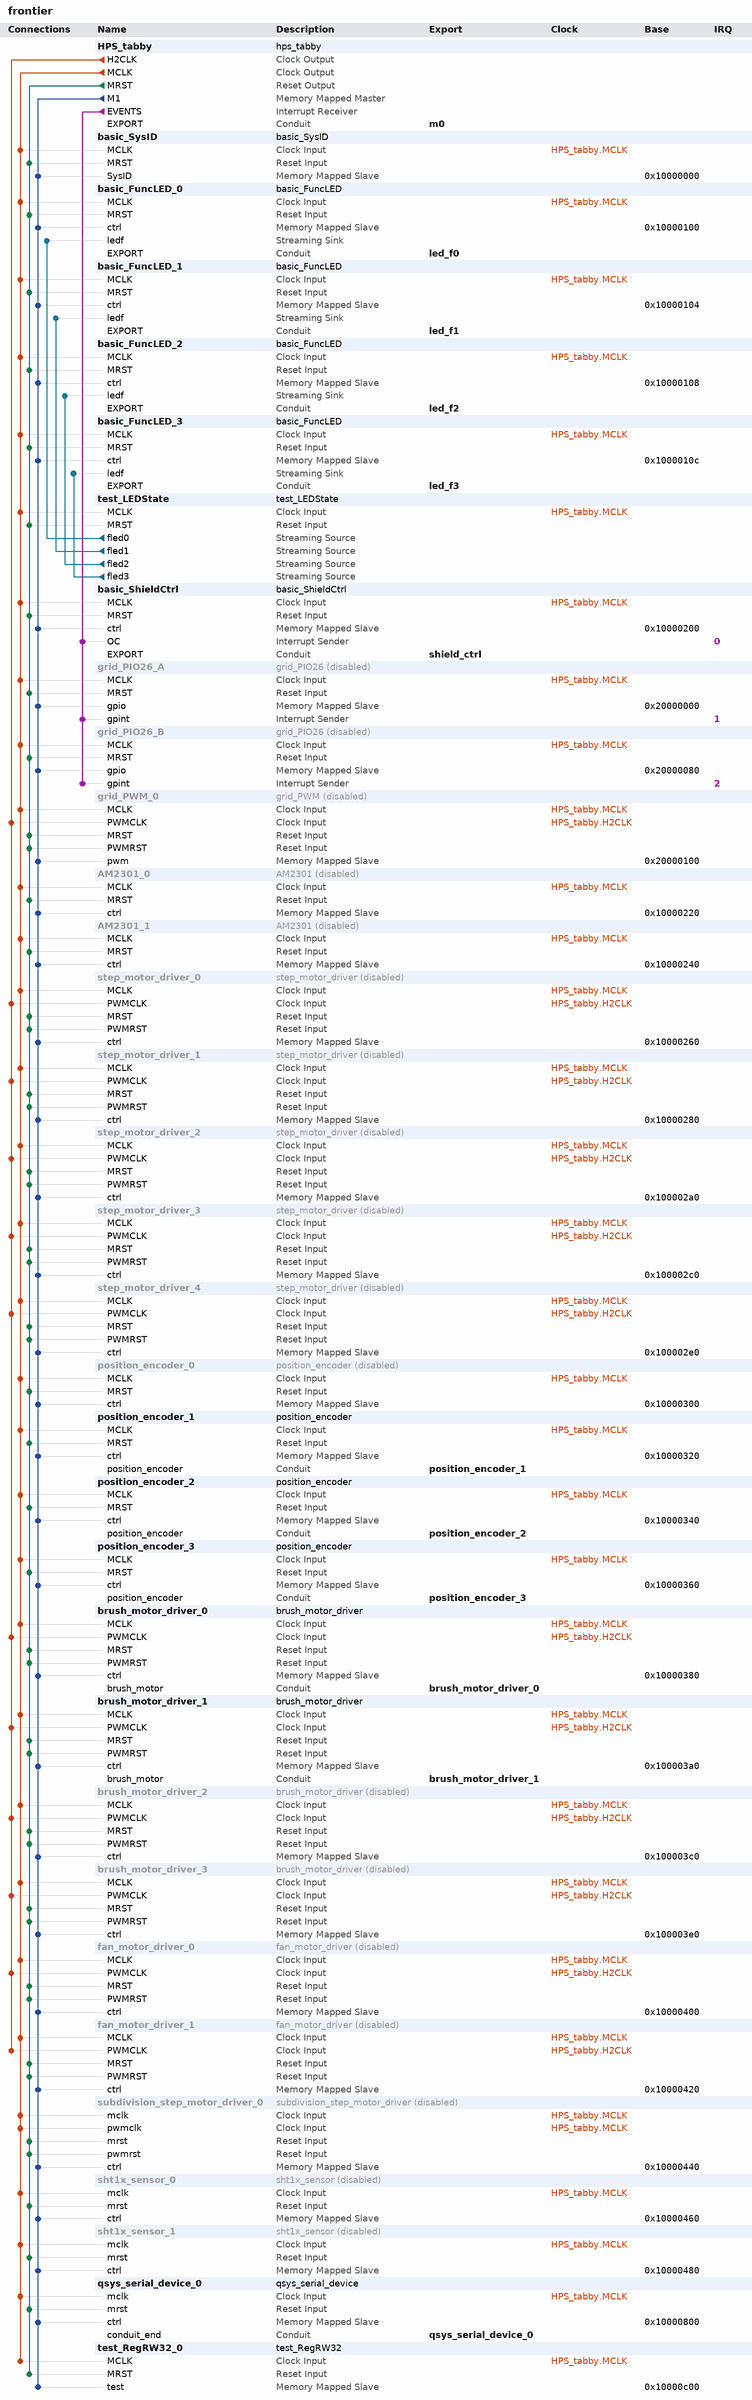
[diagram p0: system contents]
# Platform Designer (Qsys) system frontier, Cyclone IV E EP4CE15F23C8
# Parameters at their usual value, and those the tool derives, are not listed.
package require qsys
create_system frontier
set_project_property DEVICE_FAMILY {Cyclone IV E}
set_project_property DEVICE EP4CE15F23C8

add_instance HPS_tabby hps_tabby 1.1

add_instance basic_SysID basic_SysID 1.0

add_instance basic_FuncLED_0 basic_FuncLED 1.0

add_instance basic_FuncLED_1 basic_FuncLED 1.0

add_instance basic_FuncLED_2 basic_FuncLED 1.0

add_instance basic_FuncLED_3 basic_FuncLED 1.0

add_instance test_LEDState test_LEDState 1.0

add_instance basic_ShieldCtrl basic_ShieldCtrl 1.0

add_instance grid_PIO26_A grid_PIO26 1.0
set_instance_property grid_PIO26_A ENABLED false

add_instance grid_PIO26_B grid_PIO26 1.0
set_instance_property grid_PIO26_B ENABLED false

add_instance grid_PWM_0 grid_PWM 1.0
set_instance_property grid_PWM_0 ENABLED false

add_instance AM2301_0 AM2301 1.0
set_instance_property AM2301_0 ENABLED false
set_instance_parameter_value AM2301_0 high_width 20
set_instance_parameter_value AM2301_0 start_width 1000
set_instance_parameter_value AM2301_0 start 0
set_instance_parameter_value AM2301_0 start_read 1
set_instance_parameter_value AM2301_0 start_end 2
set_instance_parameter_value AM2301_0 start_low 3
set_instance_parameter_value AM2301_0 start_high 4
set_instance_parameter_value AM2301_0 bit_1_low 5
set_instance_parameter_value AM2301_0 bit_1_high 6
set_instance_parameter_value AM2301_0 bit_2_low 7
set_instance_parameter_value AM2301_0 bit_2_high 8
set_instance_parameter_value AM2301_0 bit_3_low 9
set_instance_parameter_value AM2301_0 bit_3_high 10
set_instance_parameter_value AM2301_0 bit_4_low 11
set_instance_parameter_value AM2301_0 bit_4_high 12
set_instance_parameter_value AM2301_0 bit_5_low 13
set_instance_parameter_value AM2301_0 bit_5_high 14
set_instance_parameter_value AM2301_0 bit_6_low 15
set_instance_parameter_value AM2301_0 bit_6_high 16
set_instance_parameter_value AM2301_0 bit_7_low 17
set_instance_parameter_value AM2301_0 bit_7_high 18
set_instance_parameter_value AM2301_0 bit_8_low 19
set_instance_parameter_value AM2301_0 bit_8_high 20
set_instance_parameter_value AM2301_0 bit_9_low 21
set_instance_parameter_value AM2301_0 bit_9_high 22
set_instance_parameter_value AM2301_0 bit_10_low 23
set_instance_parameter_value AM2301_0 bit_10_high 24
set_instance_parameter_value AM2301_0 bit_11_low 25
set_instance_parameter_value AM2301_0 bit_11_high 26
set_instance_parameter_value AM2301_0 bit_12_low 27
set_instance_parameter_value AM2301_0 bit_12_high 28
set_instance_parameter_value AM2301_0 bit_13_low 29
set_instance_parameter_value AM2301_0 bit_13_high 30
set_instance_parameter_value AM2301_0 bit_14_low 31
set_instance_parameter_value AM2301_0 bit_14_high 32
set_instance_parameter_value AM2301_0 bit_15_low 33
set_instance_parameter_value AM2301_0 bit_15_high 34
set_instance_parameter_value AM2301_0 bit_16_low 35
set_instance_parameter_value AM2301_0 bit_16_high 36
set_instance_parameter_value AM2301_0 bit_17_low 37
set_instance_parameter_value AM2301_0 bit_17_high 38
set_instance_parameter_value AM2301_0 bit_18_low 39
set_instance_parameter_value AM2301_0 bit_18_high 40
set_instance_parameter_value AM2301_0 bit_19_low 41
set_instance_parameter_value AM2301_0 bit_19_high 42
set_instance_parameter_value AM2301_0 bit_20_low 43
set_instance_parameter_value AM2301_0 bit_20_high 44
set_instance_parameter_value AM2301_0 bit_21_low 45
set_instance_parameter_value AM2301_0 bit_21_high 46
set_instance_parameter_value AM2301_0 bit_22_low 47
set_instance_parameter_value AM2301_0 bit_22_high 48
set_instance_parameter_value AM2301_0 bit_23_low 49
set_instance_parameter_value AM2301_0 bit_23_high 50
set_instance_parameter_value AM2301_0 bit_24_low 51
set_instance_parameter_value AM2301_0 bit_24_high 52
set_instance_parameter_value AM2301_0 bit_25_low 53
set_instance_parameter_value AM2301_0 bit_25_high 54
set_instance_parameter_value AM2301_0 bit_26_low 55
set_instance_parameter_value AM2301_0 bit_26_high 56
set_instance_parameter_value AM2301_0 bit_27_low 57
set_instance_parameter_value AM2301_0 bit_27_high 58
set_instance_parameter_value AM2301_0 bit_28_low 59
set_instance_parameter_value AM2301_0 bit_28_high 60
set_instance_parameter_value AM2301_0 bit_29_low 61
set_instance_parameter_value AM2301_0 bit_29_high 62
set_instance_parameter_value AM2301_0 bit_30_low 63
set_instance_parameter_value AM2301_0 bit_30_high 64
set_instance_parameter_value AM2301_0 bit_31_low 65
set_instance_parameter_value AM2301_0 bit_31_high 66
set_instance_parameter_value AM2301_0 bit_32_low 67
set_instance_parameter_value AM2301_0 bit_32_high 68
set_instance_parameter_value AM2301_0 ready 90
set_instance_parameter_value AM2301_0 time_2s 2000000

add_instance AM2301_1 AM2301 1.0
set_instance_property AM2301_1 ENABLED false
set_instance_parameter_value AM2301_1 high_width 20
set_instance_parameter_value AM2301_1 start_width 1000
set_instance_parameter_value AM2301_1 start 0
set_instance_parameter_value AM2301_1 start_read 1
set_instance_parameter_value AM2301_1 start_end 2
set_instance_parameter_value AM2301_1 start_low 3
set_instance_parameter_value AM2301_1 start_high 4
set_instance_parameter_value AM2301_1 bit_1_low 5
set_instance_parameter_value AM2301_1 bit_1_high 6
set_instance_parameter_value AM2301_1 bit_2_low 7
set_instance_parameter_value AM2301_1 bit_2_high 8
set_instance_parameter_value AM2301_1 bit_3_low 9
set_instance_parameter_value AM2301_1 bit_3_high 10
set_instance_parameter_value AM2301_1 bit_4_low 11
set_instance_parameter_value AM2301_1 bit_4_high 12
set_instance_parameter_value AM2301_1 bit_5_low 13
set_instance_parameter_value AM2301_1 bit_5_high 14
set_instance_parameter_value AM2301_1 bit_6_low 15
set_instance_parameter_value AM2301_1 bit_6_high 16
set_instance_parameter_value AM2301_1 bit_7_low 17
set_instance_parameter_value AM2301_1 bit_7_high 18
set_instance_parameter_value AM2301_1 bit_8_low 19
set_instance_parameter_value AM2301_1 bit_8_high 20
set_instance_parameter_value AM2301_1 bit_9_low 21
set_instance_parameter_value AM2301_1 bit_9_high 22
set_instance_parameter_value AM2301_1 bit_10_low 23
set_instance_parameter_value AM2301_1 bit_10_high 24
set_instance_parameter_value AM2301_1 bit_11_low 25
set_instance_parameter_value AM2301_1 bit_11_high 26
set_instance_parameter_value AM2301_1 bit_12_low 27
set_instance_parameter_value AM2301_1 bit_12_high 28
set_instance_parameter_value AM2301_1 bit_13_low 29
set_instance_parameter_value AM2301_1 bit_13_high 30
set_instance_parameter_value AM2301_1 bit_14_low 31
set_instance_parameter_value AM2301_1 bit_14_high 32
set_instance_parameter_value AM2301_1 bit_15_low 33
set_instance_parameter_value AM2301_1 bit_15_high 34
set_instance_parameter_value AM2301_1 bit_16_low 35
set_instance_parameter_value AM2301_1 bit_16_high 36
set_instance_parameter_value AM2301_1 bit_17_low 37
set_instance_parameter_value AM2301_1 bit_17_high 38
set_instance_parameter_value AM2301_1 bit_18_low 39
set_instance_parameter_value AM2301_1 bit_18_high 40
set_instance_parameter_value AM2301_1 bit_19_low 41
set_instance_parameter_value AM2301_1 bit_19_high 42
set_instance_parameter_value AM2301_1 bit_20_low 43
set_instance_parameter_value AM2301_1 bit_20_high 44
set_instance_parameter_value AM2301_1 bit_21_low 45
set_instance_parameter_value AM2301_1 bit_21_high 46
set_instance_parameter_value AM2301_1 bit_22_low 47
set_instance_parameter_value AM2301_1 bit_22_high 48
set_instance_parameter_value AM2301_1 bit_23_low 49
set_instance_parameter_value AM2301_1 bit_23_high 50
set_instance_parameter_value AM2301_1 bit_24_low 51
set_instance_parameter_value AM2301_1 bit_24_high 52
set_instance_parameter_value AM2301_1 bit_25_low 53
set_instance_parameter_value AM2301_1 bit_25_high 54
set_instance_parameter_value AM2301_1 bit_26_low 55
set_instance_parameter_value AM2301_1 bit_26_high 56
set_instance_parameter_value AM2301_1 bit_27_low 57
set_instance_parameter_value AM2301_1 bit_27_high 58
set_instance_parameter_value AM2301_1 bit_28_low 59
set_instance_parameter_value AM2301_1 bit_28_high 60
set_instance_parameter_value AM2301_1 bit_29_low 61
set_instance_parameter_value AM2301_1 bit_29_high 62
set_instance_parameter_value AM2301_1 bit_30_low 63
set_instance_parameter_value AM2301_1 bit_30_high 64
set_instance_parameter_value AM2301_1 bit_31_low 65
set_instance_parameter_value AM2301_1 bit_31_high 66
set_instance_parameter_value AM2301_1 bit_32_low 67
set_instance_parameter_value AM2301_1 bit_32_high 68
set_instance_parameter_value AM2301_1 ready 90
set_instance_parameter_value AM2301_1 time_2s 2000000

add_instance step_motor_driver_0 step_motor_driver 1.0
set_instance_property step_motor_driver_0 ENABLED false

add_instance step_motor_driver_1 step_motor_driver 1.0
set_instance_property step_motor_driver_1 ENABLED false

add_instance step_motor_driver_2 step_motor_driver 1.0
set_instance_property step_motor_driver_2 ENABLED false

add_instance step_motor_driver_3 step_motor_driver 1.0
set_instance_property step_motor_driver_3 ENABLED false

add_instance step_motor_driver_4 step_motor_driver 1.0
set_instance_property step_motor_driver_4 ENABLED false

add_instance position_encoder_0 position_encoder 1.0
set_instance_property position_encoder_0 ENABLED false

add_instance position_encoder_1 position_encoder 1.0

add_instance position_encoder_2 position_encoder 1.0

add_instance position_encoder_3 position_encoder 1.0

add_instance brush_motor_driver_0 brush_motor_driver 1.0

add_instance brush_motor_driver_1 brush_motor_driver 1.0

add_instance brush_motor_driver_2 brush_motor_driver 1.0
set_instance_property brush_motor_driver_2 ENABLED false

add_instance brush_motor_driver_3 brush_motor_driver 1.0
set_instance_property brush_motor_driver_3 ENABLED false

add_instance fan_motor_driver_0 fan_motor_driver 1.0
set_instance_property fan_motor_driver_0 ENABLED false

add_instance fan_motor_driver_1 fan_motor_driver 1.0
set_instance_property fan_motor_driver_1 ENABLED false

add_instance subdivision_step_motor_driver_0 subdivision_step_motor_driver 1.0
set_instance_property subdivision_step_motor_driver_0 ENABLED false

add_instance sht1x_sensor_0 sht1x_sensor 1.0
set_instance_property sht1x_sensor_0 ENABLED false
set_instance_parameter_value sht1x_sensor_0 Address 0
set_instance_parameter_value sht1x_sensor_0 Measure_Temperature 3
set_instance_parameter_value sht1x_sensor_0 Measure_Relative_Humidity 5
set_instance_parameter_value sht1x_sensor_0 Read_Status_Register 7
set_instance_parameter_value sht1x_sensor_0 Write_Status_Register 6
set_instance_parameter_value sht1x_sensor_0 dir_out 1
set_instance_parameter_value sht1x_sensor_0 dir_in 0
set_instance_parameter_value sht1x_sensor_0 Reset_0 0

add_instance sht1x_sensor_1 sht1x_sensor 1.0
set_instance_property sht1x_sensor_1 ENABLED false
set_instance_parameter_value sht1x_sensor_1 Address 0
set_instance_parameter_value sht1x_sensor_1 Measure_Temperature 3
set_instance_parameter_value sht1x_sensor_1 Measure_Relative_Humidity 5
set_instance_parameter_value sht1x_sensor_1 Read_Status_Register 7
set_instance_parameter_value sht1x_sensor_1 Write_Status_Register 6
set_instance_parameter_value sht1x_sensor_1 dir_out 1
set_instance_parameter_value sht1x_sensor_1 dir_in 0
set_instance_parameter_value sht1x_sensor_1 Reset_0 0

add_instance qsys_serial_device_0 qsys_serial_device 1.0
set_instance_parameter_value qsys_serial_device_0 address_size 8

add_instance test_RegRW32_0 test_RegRW32 1.0

# connections
add_connection HPS_tabby.H2CLK brush_motor_driver_0.PWMCLK clock
add_connection HPS_tabby.H2CLK brush_motor_driver_1.PWMCLK clock
add_connection HPS_tabby.H2CLK brush_motor_driver_2.PWMCLK clock
add_connection HPS_tabby.H2CLK brush_motor_driver_3.PWMCLK clock
add_connection HPS_tabby.H2CLK fan_motor_driver_0.PWMCLK clock
add_connection HPS_tabby.H2CLK fan_motor_driver_1.PWMCLK clock
add_connection HPS_tabby.H2CLK grid_PWM_0.PWMCLK clock
add_connection HPS_tabby.H2CLK step_motor_driver_0.PWMCLK clock
add_connection HPS_tabby.H2CLK step_motor_driver_1.PWMCLK clock
add_connection HPS_tabby.H2CLK step_motor_driver_2.PWMCLK clock
add_connection HPS_tabby.H2CLK step_motor_driver_3.PWMCLK clock
add_connection HPS_tabby.H2CLK step_motor_driver_4.PWMCLK clock
add_connection HPS_tabby.MCLK AM2301_0.MCLK clock
add_connection HPS_tabby.MCLK AM2301_1.MCLK clock
add_connection HPS_tabby.MCLK basic_FuncLED_0.MCLK clock
add_connection HPS_tabby.MCLK basic_FuncLED_1.MCLK clock
add_connection HPS_tabby.MCLK basic_FuncLED_2.MCLK clock
add_connection HPS_tabby.MCLK basic_FuncLED_3.MCLK clock
add_connection HPS_tabby.MCLK basic_ShieldCtrl.MCLK clock
add_connection HPS_tabby.MCLK basic_SysID.MCLK clock
add_connection HPS_tabby.MCLK brush_motor_driver_0.MCLK clock
add_connection HPS_tabby.MCLK brush_motor_driver_1.MCLK clock
add_connection HPS_tabby.MCLK brush_motor_driver_2.MCLK clock
add_connection HPS_tabby.MCLK brush_motor_driver_3.MCLK clock
add_connection HPS_tabby.MCLK fan_motor_driver_0.MCLK clock
add_connection HPS_tabby.MCLK fan_motor_driver_1.MCLK clock
add_connection HPS_tabby.MCLK grid_PIO26_A.MCLK clock
add_connection HPS_tabby.MCLK grid_PIO26_B.MCLK clock
add_connection HPS_tabby.MCLK grid_PWM_0.MCLK clock
add_connection HPS_tabby.MCLK position_encoder_0.MCLK clock
add_connection HPS_tabby.MCLK position_encoder_1.MCLK clock
add_connection HPS_tabby.MCLK position_encoder_2.MCLK clock
add_connection HPS_tabby.MCLK position_encoder_3.MCLK clock
add_connection HPS_tabby.MCLK qsys_serial_device_0.mclk clock
add_connection HPS_tabby.MCLK sht1x_sensor_0.mclk clock
add_connection HPS_tabby.MCLK sht1x_sensor_1.mclk clock
add_connection HPS_tabby.MCLK step_motor_driver_0.MCLK clock
add_connection HPS_tabby.MCLK step_motor_driver_1.MCLK clock
add_connection HPS_tabby.MCLK step_motor_driver_2.MCLK clock
add_connection HPS_tabby.MCLK step_motor_driver_3.MCLK clock
add_connection HPS_tabby.MCLK step_motor_driver_4.MCLK clock
add_connection HPS_tabby.MCLK subdivision_step_motor_driver_0.mclk clock
add_connection HPS_tabby.MCLK subdivision_step_motor_driver_0.pwmclk clock
add_connection HPS_tabby.MCLK test_LEDState.MCLK clock
add_connection HPS_tabby.MCLK test_RegRW32_0.MCLK clock
add_connection HPS_tabby.MRST AM2301_0.MRST reset
add_connection HPS_tabby.MRST AM2301_1.MRST reset
add_connection HPS_tabby.MRST basic_FuncLED_0.MRST reset
add_connection HPS_tabby.MRST basic_FuncLED_1.MRST reset
add_connection HPS_tabby.MRST basic_FuncLED_2.MRST reset
add_connection HPS_tabby.MRST basic_FuncLED_3.MRST reset
add_connection HPS_tabby.MRST basic_ShieldCtrl.MRST reset
add_connection HPS_tabby.MRST basic_SysID.MRST reset
add_connection HPS_tabby.MRST brush_motor_driver_0.MRST reset
add_connection HPS_tabby.MRST brush_motor_driver_0.PWMRST reset
add_connection HPS_tabby.MRST brush_motor_driver_1.MRST reset
add_connection HPS_tabby.MRST brush_motor_driver_1.PWMRST reset
add_connection HPS_tabby.MRST brush_motor_driver_2.MRST reset
add_connection HPS_tabby.MRST brush_motor_driver_2.PWMRST reset
add_connection HPS_tabby.MRST brush_motor_driver_3.MRST reset
add_connection HPS_tabby.MRST brush_motor_driver_3.PWMRST reset
add_connection HPS_tabby.MRST fan_motor_driver_0.MRST reset
add_connection HPS_tabby.MRST fan_motor_driver_0.PWMRST reset
add_connection HPS_tabby.MRST fan_motor_driver_1.MRST reset
add_connection HPS_tabby.MRST fan_motor_driver_1.PWMRST reset
add_connection HPS_tabby.MRST grid_PIO26_A.MRST reset
add_connection HPS_tabby.MRST grid_PIO26_B.MRST reset
add_connection HPS_tabby.MRST grid_PWM_0.MRST reset
add_connection HPS_tabby.MRST grid_PWM_0.PWMRST reset
add_connection HPS_tabby.MRST position_encoder_0.MRST reset
add_connection HPS_tabby.MRST position_encoder_1.MRST reset
add_connection HPS_tabby.MRST position_encoder_2.MRST reset
add_connection HPS_tabby.MRST position_encoder_3.MRST reset
add_connection HPS_tabby.MRST qsys_serial_device_0.mrst reset
add_connection HPS_tabby.MRST sht1x_sensor_0.mrst reset
add_connection HPS_tabby.MRST sht1x_sensor_1.mrst reset
add_connection HPS_tabby.MRST step_motor_driver_0.MRST reset
add_connection HPS_tabby.MRST step_motor_driver_0.PWMRST reset
add_connection HPS_tabby.MRST step_motor_driver_1.MRST reset
add_connection HPS_tabby.MRST step_motor_driver_1.PWMRST reset
add_connection HPS_tabby.MRST step_motor_driver_2.MRST reset
add_connection HPS_tabby.MRST step_motor_driver_2.PWMRST reset
add_connection HPS_tabby.MRST step_motor_driver_3.MRST reset
add_connection HPS_tabby.MRST step_motor_driver_3.PWMRST reset
add_connection HPS_tabby.MRST step_motor_driver_4.MRST reset
add_connection HPS_tabby.MRST step_motor_driver_4.PWMRST reset
add_connection HPS_tabby.MRST subdivision_step_motor_driver_0.mrst reset
add_connection HPS_tabby.MRST subdivision_step_motor_driver_0.pwmrst reset
add_connection HPS_tabby.MRST test_LEDState.MRST reset
add_connection HPS_tabby.MRST test_RegRW32_0.MRST reset
add_connection HPS_tabby.M1 AM2301_0.ctrl avalon
set_connection_parameter_value HPS_tabby.M1/AM2301_0.ctrl baseAddress 0x10000220
add_connection HPS_tabby.M1 AM2301_1.ctrl avalon
set_connection_parameter_value HPS_tabby.M1/AM2301_1.ctrl baseAddress 0x10000240
add_connection HPS_tabby.M1 basic_FuncLED_0.ctrl avalon
set_connection_parameter_value HPS_tabby.M1/basic_FuncLED_0.ctrl baseAddress 0x10000100
add_connection HPS_tabby.M1 basic_FuncLED_1.ctrl avalon
set_connection_parameter_value HPS_tabby.M1/basic_FuncLED_1.ctrl baseAddress 0x10000104
add_connection HPS_tabby.M1 basic_FuncLED_2.ctrl avalon
set_connection_parameter_value HPS_tabby.M1/basic_FuncLED_2.ctrl baseAddress 0x10000108
add_connection HPS_tabby.M1 basic_FuncLED_3.ctrl avalon
set_connection_parameter_value HPS_tabby.M1/basic_FuncLED_3.ctrl baseAddress 0x1000010c
add_connection HPS_tabby.M1 basic_ShieldCtrl.ctrl avalon
set_connection_parameter_value HPS_tabby.M1/basic_ShieldCtrl.ctrl baseAddress 0x10000200
add_connection HPS_tabby.M1 basic_SysID.SysID avalon
set_connection_parameter_value HPS_tabby.M1/basic_SysID.SysID baseAddress 0x10000000
add_connection HPS_tabby.M1 brush_motor_driver_0.ctrl avalon
set_connection_parameter_value HPS_tabby.M1/brush_motor_driver_0.ctrl baseAddress 0x10000380
add_connection HPS_tabby.M1 brush_motor_driver_1.ctrl avalon
set_connection_parameter_value HPS_tabby.M1/brush_motor_driver_1.ctrl baseAddress 0x100003a0
add_connection HPS_tabby.M1 brush_motor_driver_2.ctrl avalon
set_connection_parameter_value HPS_tabby.M1/brush_motor_driver_2.ctrl baseAddress 0x100003c0
add_connection HPS_tabby.M1 brush_motor_driver_3.ctrl avalon
set_connection_parameter_value HPS_tabby.M1/brush_motor_driver_3.ctrl baseAddress 0x100003e0
add_connection HPS_tabby.M1 fan_motor_driver_0.ctrl avalon
set_connection_parameter_value HPS_tabby.M1/fan_motor_driver_0.ctrl baseAddress 0x10000400
add_connection HPS_tabby.M1 fan_motor_driver_1.ctrl avalon
set_connection_parameter_value HPS_tabby.M1/fan_motor_driver_1.ctrl baseAddress 0x10000420
add_connection HPS_tabby.M1 grid_PIO26_A.gpio avalon
set_connection_parameter_value HPS_tabby.M1/grid_PIO26_A.gpio baseAddress 0x20000000
add_connection HPS_tabby.M1 grid_PIO26_B.gpio avalon
set_connection_parameter_value HPS_tabby.M1/grid_PIO26_B.gpio baseAddress 0x20000080
add_connection HPS_tabby.M1 grid_PWM_0.pwm avalon
set_connection_parameter_value HPS_tabby.M1/grid_PWM_0.pwm baseAddress 0x20000100
add_connection HPS_tabby.M1 position_encoder_0.ctrl avalon
set_connection_parameter_value HPS_tabby.M1/position_encoder_0.ctrl baseAddress 0x10000300
add_connection HPS_tabby.M1 position_encoder_1.ctrl avalon
set_connection_parameter_value HPS_tabby.M1/position_encoder_1.ctrl baseAddress 0x10000320
add_connection HPS_tabby.M1 position_encoder_2.ctrl avalon
set_connection_parameter_value HPS_tabby.M1/position_encoder_2.ctrl baseAddress 0x10000340
add_connection HPS_tabby.M1 position_encoder_3.ctrl avalon
set_connection_parameter_value HPS_tabby.M1/position_encoder_3.ctrl baseAddress 0x10000360
add_connection HPS_tabby.M1 qsys_serial_device_0.ctrl avalon
set_connection_parameter_value HPS_tabby.M1/qsys_serial_device_0.ctrl baseAddress 0x10000800
add_connection HPS_tabby.M1 sht1x_sensor_0.ctrl avalon
set_connection_parameter_value HPS_tabby.M1/sht1x_sensor_0.ctrl baseAddress 0x10000460
add_connection HPS_tabby.M1 sht1x_sensor_1.ctrl avalon
set_connection_parameter_value HPS_tabby.M1/sht1x_sensor_1.ctrl baseAddress 0x10000480
add_connection HPS_tabby.M1 step_motor_driver_0.ctrl avalon
set_connection_parameter_value HPS_tabby.M1/step_motor_driver_0.ctrl baseAddress 0x10000260
add_connection HPS_tabby.M1 step_motor_driver_1.ctrl avalon
set_connection_parameter_value HPS_tabby.M1/step_motor_driver_1.ctrl baseAddress 0x10000280
add_connection HPS_tabby.M1 step_motor_driver_2.ctrl avalon
set_connection_parameter_value HPS_tabby.M1/step_motor_driver_2.ctrl baseAddress 0x100002a0
add_connection HPS_tabby.M1 step_motor_driver_3.ctrl avalon
set_connection_parameter_value HPS_tabby.M1/step_motor_driver_3.ctrl baseAddress 0x100002c0
add_connection HPS_tabby.M1 step_motor_driver_4.ctrl avalon
set_connection_parameter_value HPS_tabby.M1/step_motor_driver_4.ctrl baseAddress 0x100002e0
add_connection HPS_tabby.M1 subdivision_step_motor_driver_0.ctrl avalon
set_connection_parameter_value HPS_tabby.M1/subdivision_step_motor_driver_0.ctrl baseAddress 0x10000440
add_connection HPS_tabby.M1 test_RegRW32_0.test avalon
set_connection_parameter_value HPS_tabby.M1/test_RegRW32_0.test baseAddress 0x10000c00
add_connection test_LEDState.fled0 basic_FuncLED_0.ledf avalon_streaming
add_connection test_LEDState.fled1 basic_FuncLED_1.ledf avalon_streaming
add_connection test_LEDState.fled2 basic_FuncLED_2.ledf avalon_streaming
add_connection test_LEDState.fled3 basic_FuncLED_3.ledf avalon_streaming
add_connection HPS_tabby.EVENTS basic_ShieldCtrl.OC interrupt
set_connection_parameter_value HPS_tabby.EVENTS/basic_ShieldCtrl.OC irqNumber 0
add_connection HPS_tabby.EVENTS grid_PIO26_A.gpint interrupt
set_connection_parameter_value HPS_tabby.EVENTS/grid_PIO26_A.gpint irqNumber 1
add_connection HPS_tabby.EVENTS grid_PIO26_B.gpint interrupt
set_connection_parameter_value HPS_tabby.EVENTS/grid_PIO26_B.gpint irqNumber 2

# exported interfaces
add_interface m0 conduit end
set_interface_property m0 EXPORT_OF HPS_tabby.EXPORT
add_interface led_f0 conduit end
set_interface_property led_f0 EXPORT_OF basic_FuncLED_0.EXPORT
add_interface led_f1 conduit end
set_interface_property led_f1 EXPORT_OF basic_FuncLED_1.EXPORT
add_interface led_f2 conduit end
set_interface_property led_f2 EXPORT_OF basic_FuncLED_2.EXPORT
add_interface led_f3 conduit end
set_interface_property led_f3 EXPORT_OF basic_FuncLED_3.EXPORT
add_interface shield_ctrl conduit end
set_interface_property shield_ctrl EXPORT_OF basic_ShieldCtrl.EXPORT
add_interface brush_motor_driver_1 conduit end
set_interface_property brush_motor_driver_1 EXPORT_OF brush_motor_driver_1.brush_motor
add_interface position_encoder_1 conduit end
set_interface_property position_encoder_1 EXPORT_OF position_encoder_1.position_encoder
add_interface position_encoder_2 conduit end
set_interface_property position_encoder_2 EXPORT_OF position_encoder_2.position_encoder
add_interface position_encoder_3 conduit end
set_interface_property position_encoder_3 EXPORT_OF position_encoder_3.position_encoder
add_interface brush_motor_driver_0 conduit end
set_interface_property brush_motor_driver_0 EXPORT_OF brush_motor_driver_0.brush_motor
add_interface qsys_serial_device_0 conduit end
set_interface_property qsys_serial_device_0 EXPORT_OF qsys_serial_device_0.conduit_end

save_system frontier.qsys
